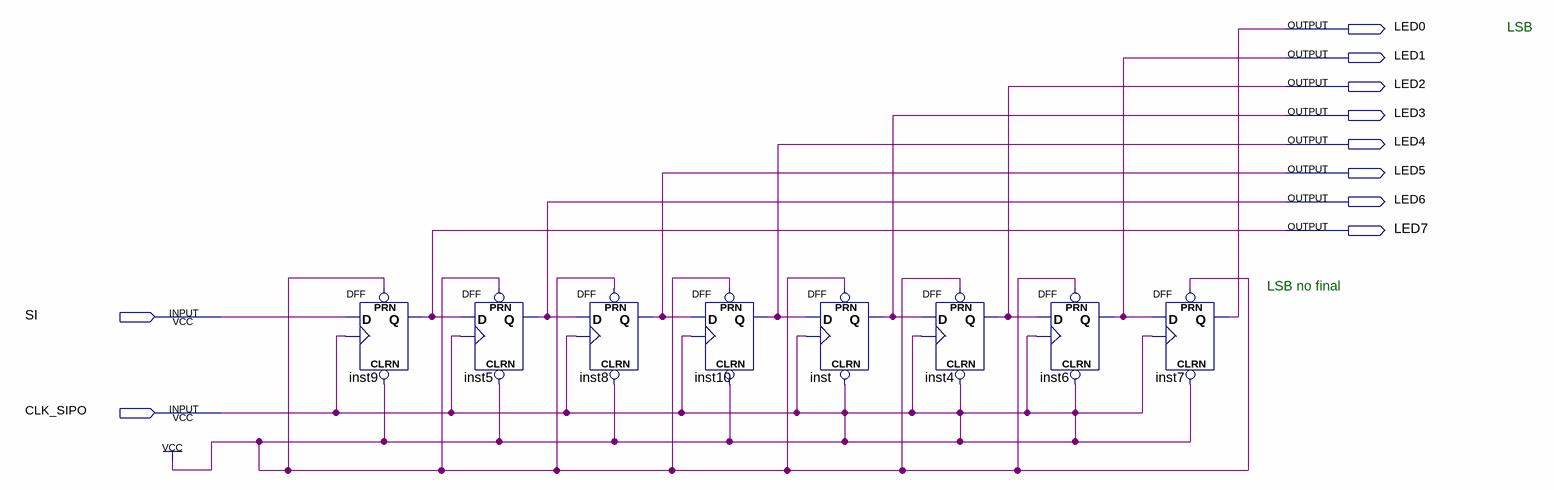
[diagram p0: schematic sheet]
// Quartus schematic SIPO-leds.bdf as structural Verilog: 8 symbols, 10 pins
module \SIPO-leds  (
  input  SI,
  input  CLK_SIPO,
  output LED0,
  output LED1,
  output LED2,
  output LED3,
  output LED4,
  output LED5,
  output LED6,
  output LED7
);

  DFF inst9 (.CLRN(CLK_SIPO), .CLK(CLK_SIPO), .D(SI), .PRN(CLK_SIPO), .Q(LED7));
  DFF inst5 (.CLRN(CLK_SIPO), .CLK(CLK_SIPO), .D(LED7), .PRN(CLK_SIPO), .Q(LED6));
  DFF inst8 (.CLRN(CLK_SIPO), .CLK(CLK_SIPO), .D(LED6), .PRN(CLK_SIPO), .Q(LED5));
  DFF inst10 (.CLRN(CLK_SIPO), .CLK(CLK_SIPO), .D(LED5), .PRN(CLK_SIPO), .Q(LED4));
  DFF inst (.CLRN(CLK_SIPO), .CLK(CLK_SIPO), .D(LED4), .PRN(CLK_SIPO), .Q(LED3));
  DFF inst4 (.CLRN(CLK_SIPO), .CLK(CLK_SIPO), .D(LED3), .PRN(CLK_SIPO), .Q(LED2));
  DFF inst6 (.CLRN(CLK_SIPO), .CLK(CLK_SIPO), .D(LED2), .PRN(CLK_SIPO), .Q(LED1));
  DFF inst7 (.CLRN(CLK_SIPO), .CLK(CLK_SIPO), .D(LED1), .PRN(CLK_SIPO), .Q(LED0));
  // also tied to VCC on the sheet: CLK_SIPO

  // Notes on the sheet:
  //   LSB
  //   LSB no final
endmodule
